# EasyEDA schematic schematic.json
TITLE: The Rat Machine; REV: 1.0; Date: 2024-09-14; Sheet: 1/1; Drawn By: Joey Lent; Company: Joey Lent
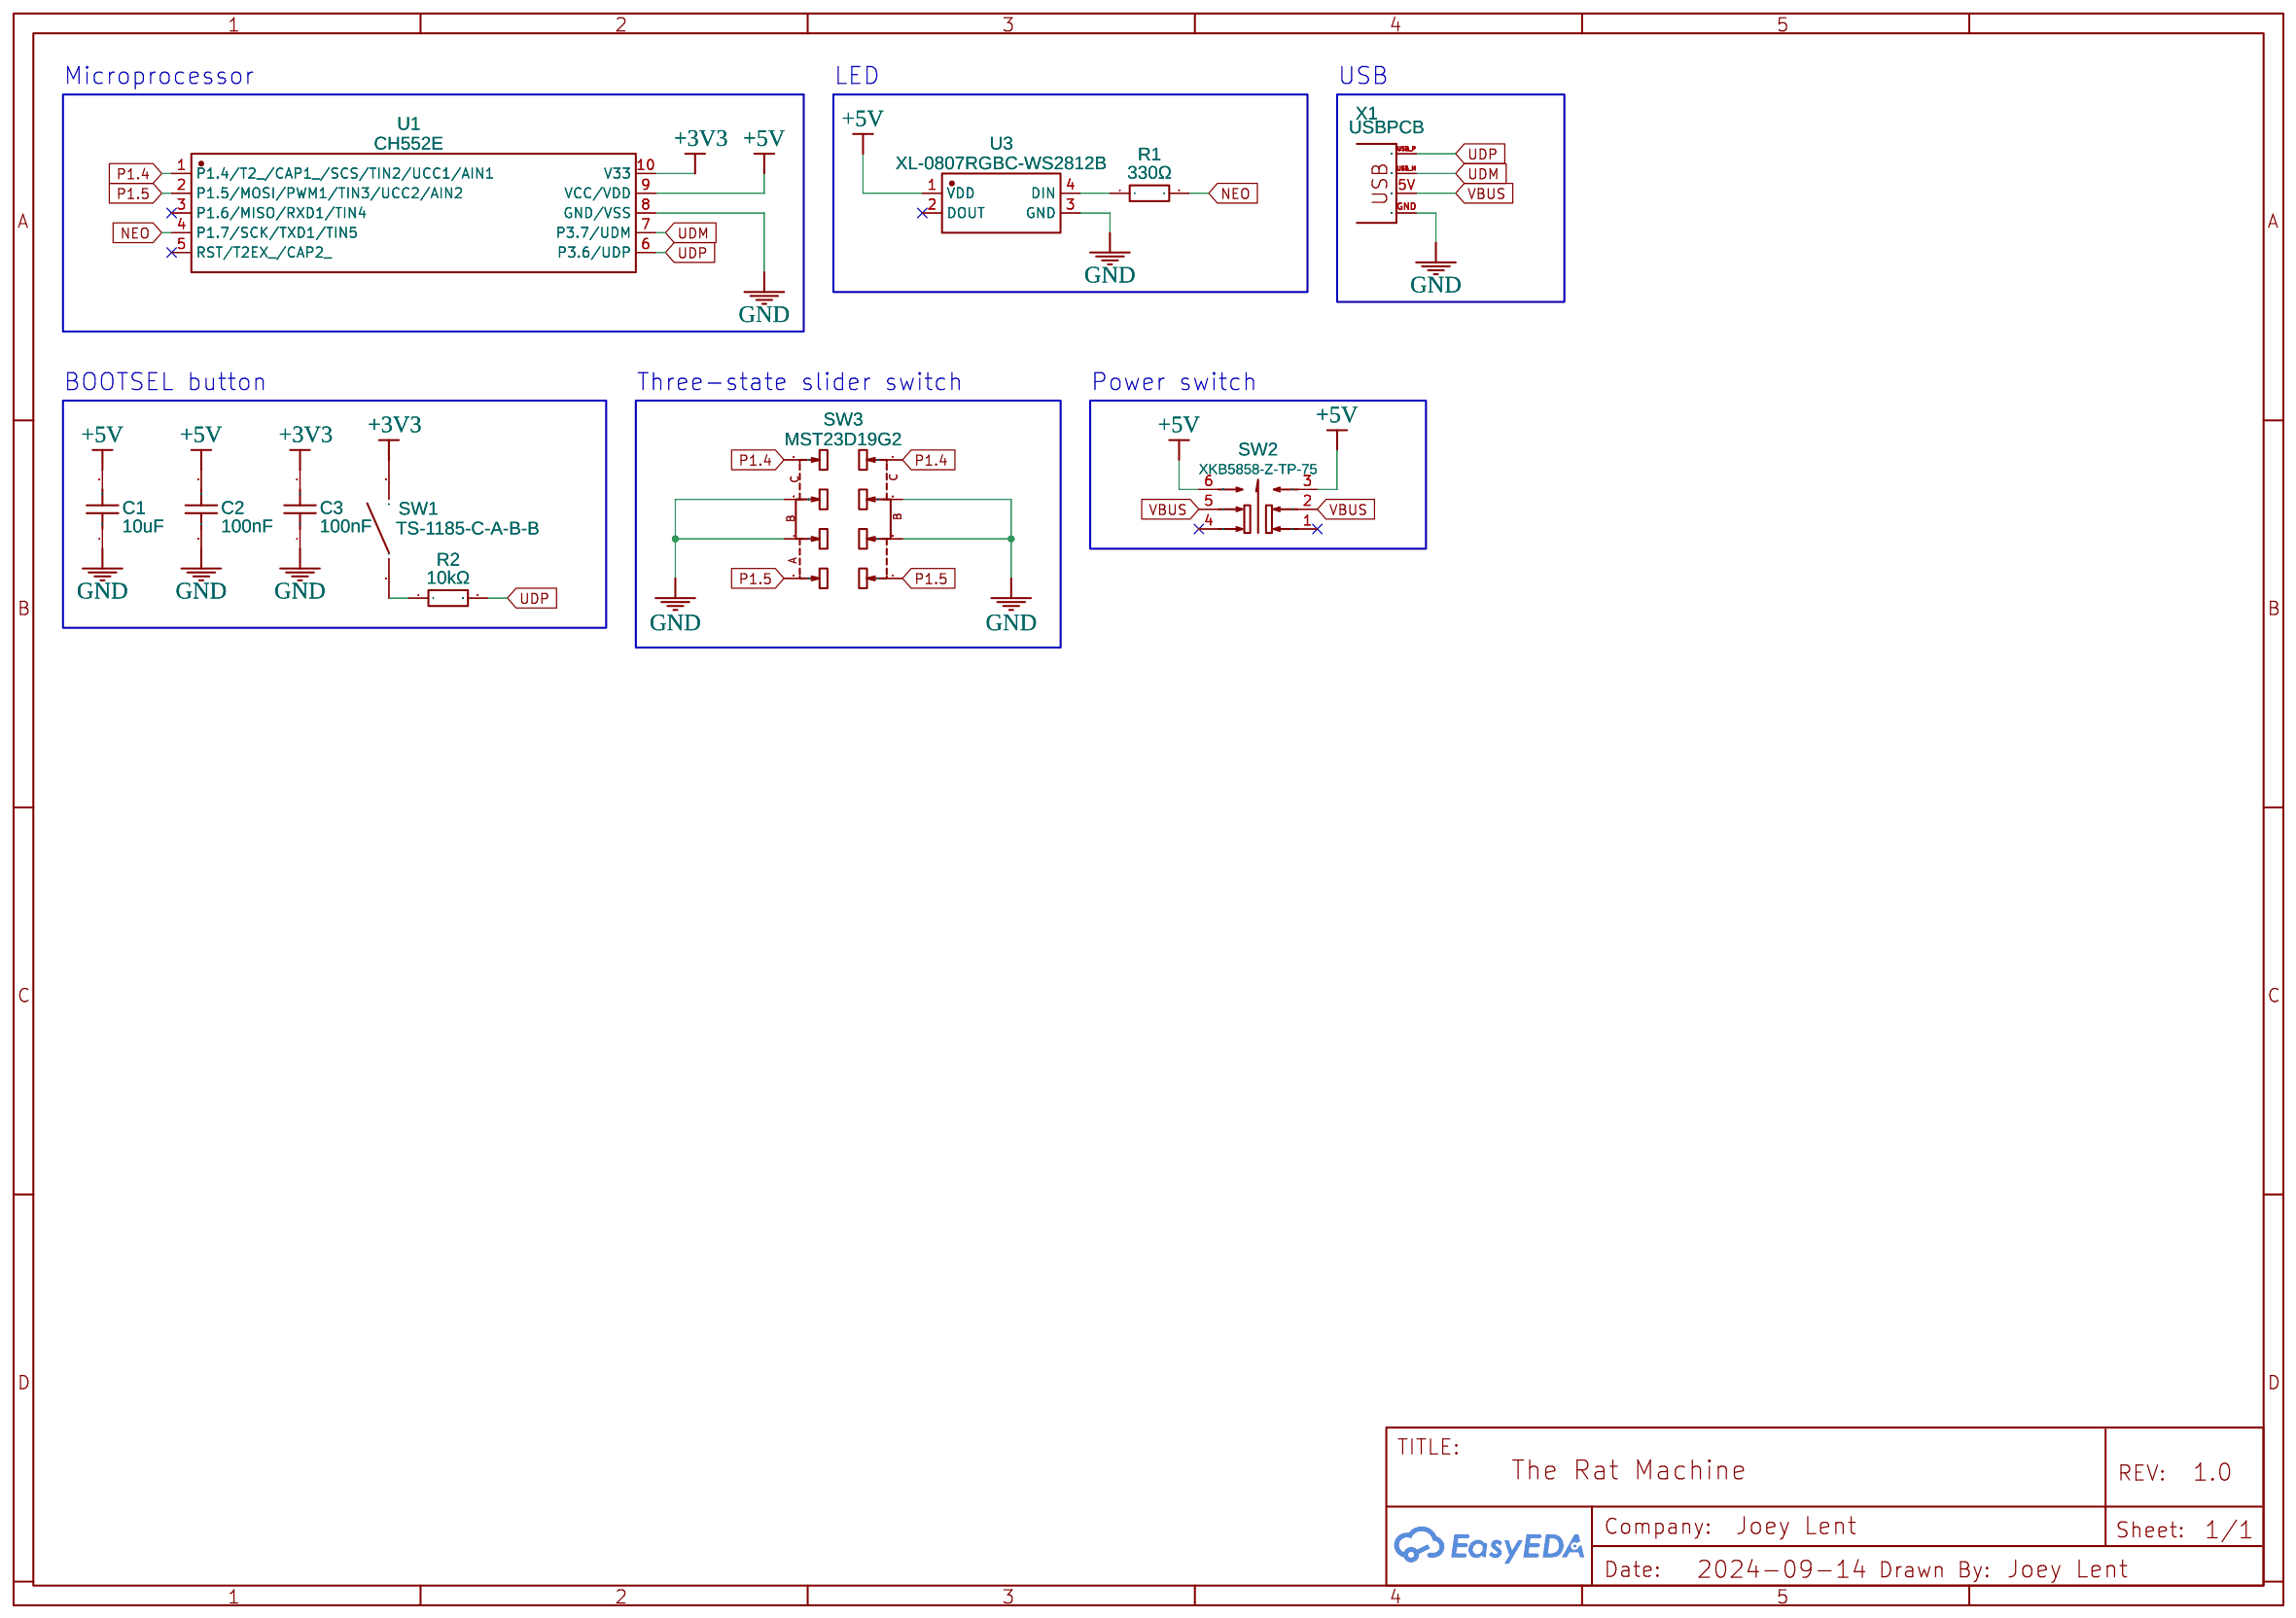
[diagram p0: schematic sheet]

## Parts
C1  10uF  [C0603]
C2  100nF  [C0603]
C3  100nF  [C0603]
R1  330Ω  [R0603]
R2  10kΩ  [R0603]
SW1  TS-1185-C-A-B-B  [SW-SMD_L4.0-W2.9-LS5.0]
SW2  XKB5858-Z-TP-75  [SW-SMD_6P-L5.8-W5.8-P2.00-LS8.3]
SW3  MST23D19G2  [SW-SMD_MST23D19G2]
U1  CH552E  [MSOP-10_L3.0-W3.0-P0.50-LS5.0-BL]
U3  XL-0807RGBC-WS2812B  [LED-SMD_4P-L2.0-W1.8_CY-0807]
X1  USBPCB  [USB-A-PCB]

## Library data of the parts
C1 = CL10A106KP8NNNC: Supplier: LCSC; Manufacturer: SAMSUNG(三星); Supplier Part: C19702; JLCPCB Part Class: Basic Part
C2 C3 = CC0603KRX7R9BB104: Supplier: LCSC; Manufacturer: YAGEO(国巨); Supplier Part: C14663; JLCPCB Part Class: Basic Part
R1 = 0603WAF3300T5E: Supplier: LCSC; Manufacturer: UNI-ROYAL(厚声); Supplier Part: C23138; JLCPCB Part Class: Basic Part
R2 = 0603WAF1002T5E: Supplier: LCSC; Manufacturer: UNI-ROYAL(厚声); Supplier Part: C25804; JLCPCB Part Class: Basic Part
SW1 = TS-1185-C-A-B-B: Contributor: LCSC; Supplier: LCSC; Supplier Part: C465999; Manufacturer: XKB Connectivity(中国星坤); JLCPCB Part Class: Extended Part
SW2 = XKB5858-Z-TP-75: Contributor: LCSC; Supplier: LCSC; Supplier Part: C692487; Manufacturer: XKB Connectivity(中国星坤); JLCPCB Part Class: Extended Part
SW3 = MST23D19G2: Contributor: LCSC; Supplier: LCSC; Supplier Part: C431545; Manufacturer: SHOU HAN(首韩); JLCPCB Part Class: Extended Part
U1 = CH552E: Contributor: LCSC; Supplier: LCSC; Supplier Part: C967938; Manufacturer: WCH(南京沁恒); JLCPCB Part Class: Extended Part
U3 = XL-0807RGBC-WS2812B: Contributor: lcsc; Supplier: LCSC; Supplier Part: C3646929; Manufacturer: XINGLIGHT(成兴光); JLCPCB Part Class: Extended Part
X1 = USBPCB: Contributor: i998

## Nets
+3V3: C3.2 SW1.2 U1.10(V33)
+5V: C1.2 C2.2 SW2.3 SW2.6 U1.9(VCC/VDD) U3.1(VDD)
GND: C1.1 C2.1 C3.1 SW3.2 SW3.3 SW3.6 SW3.7 U1.8(GND/VSS) U3.3(GND) X1.GND
VBUS: SW2.2 SW2.5 X1.5V(VBUS)
NEO: R1.2 U1.4(P1.7/SCK/TXD1/TIN5)
P1.4: SW3.4 SW3.5 U1.1(P1.4/T2_/CAP1_/SCS/TIN2/UCC1/AIN1)
P1.5: SW3.1 SW3.8 U1.2(P1.5/MOSI/PWM1/TIN3/UCC2/AIN2)
UDM: U1.7(P3.7/UDM) X1.USB_M(D-)
UDP: R2.2 U1.6(P3.6/UDP) X1.USB_P(D+)
Net-(R1-1): R1.1 U3.4(DIN)
Net-(R2-1): R2.1 SW1.1

Not connected (* = marked no-connect by the designer): SW2 1* 4*; U1 3(P1.6/MISO/RXD1/TIN4)* 5(RST/T2EX_/CAP2_)*; U3 2(DOUT)*

## Notes on the sheet
- Microprocessor
- LED
- USB
- BOOTSEL button
- Three-state slider switch
- Power switch
